# EAGLE schematic TX_test (EAGLE 9.5.0)
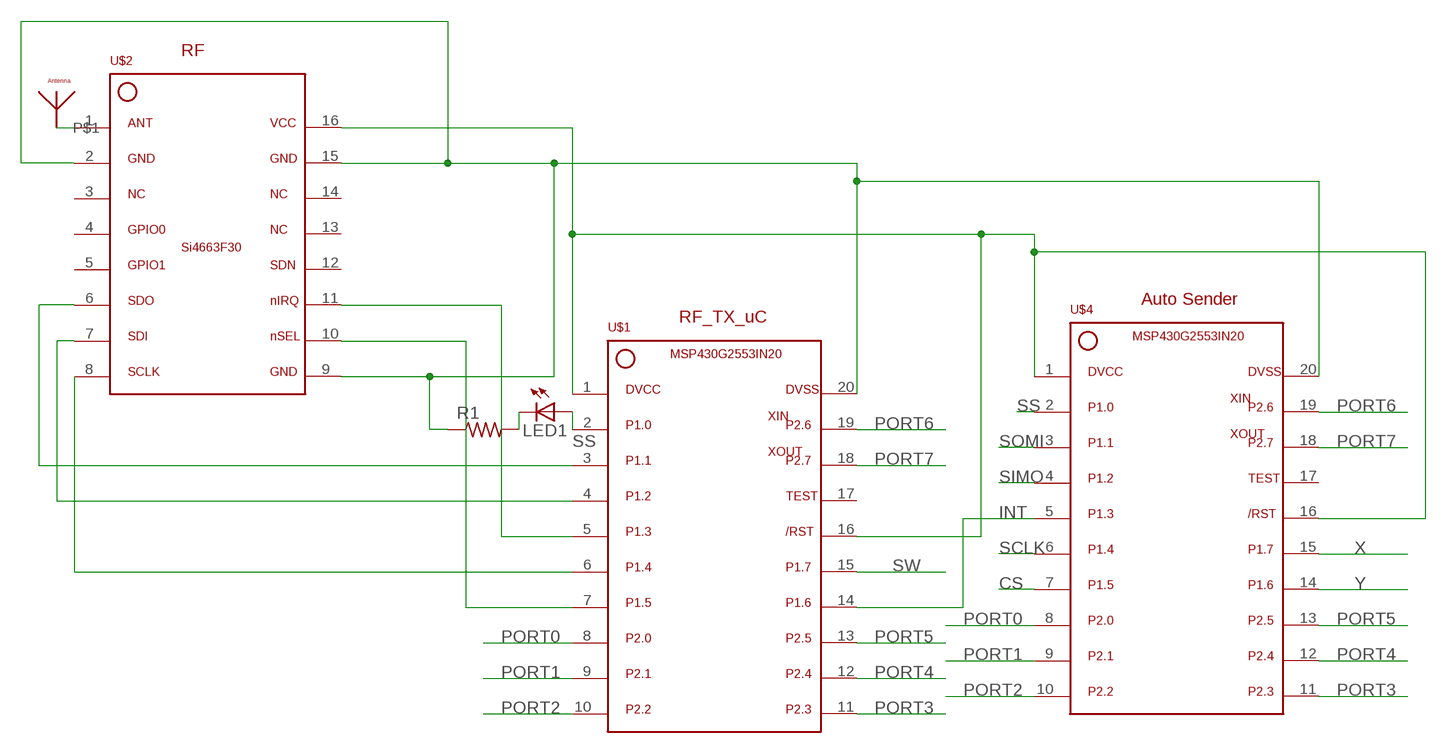
[diagram p0: schematic, sheet 1]

## Parts
LED1  LED3MM  [LED3MM]
R1  R-US_0204/7  [0204/7]
U$1  MSP430G2553IN20  [DIP762W53P254L2215H508Q20B]
U$2  SI4663F30SI4663F30-3D  [INDCAV400P3800X2000X400-16N]
U$3  ANTENNA  [ANTENNA]
U$4  MSP430G2553IN20  [DIP762W53P254L2215H508Q20B]

## Nets
CS: U$4.7
INT: U$1.14 U$4.5
N$1: U$1.1 U$1.16 U$2.16 U$4.1 U$4.16
N$2: U$2.1 U$3.P$1
N$3: R1.1 U$1.20 U$2.2 U$2.9 U$2.15 U$4.20
N$5: U$1.7 U$2.10
N$6: U$1.3 U$2.6
N$7: U$1.4 U$2.7
N$8: U$1.6 U$2.8
N$9: U$1.5 U$2.11
N$10: LED1.K(C) R1.2
PORT0: U$1.8 U$4.8
PORT1: U$1.9 U$4.9
PORT2: U$1.10 U$4.10
PORT3: U$1.11 U$4.11
PORT4: U$1.12 U$4.12
PORT5: U$1.13 U$4.13
PORT6: U$1.19 U$4.19
PORT7: U$1.18 U$4.18
SCLK: U$4.6
SIMO: U$4.4
SOMI: U$4.3
SS: LED1.A U$1.2 U$4.2
SW: U$1.15
X: U$4.15
Y: U$4.14
Unconnected: U$1.17 U$2.3 U$2.4 U$2.5 U$2.12 U$2.13 U$2.14 U$4.17

## Notes on the sheet
- RF
- Auto Sender
- RF_TX_uC

## Library data of the parts
LED1 = Phase_2:LED: LED OSRAM: - CHIPLED LG R971, LG N971, LY N971, LG Q971, LY Q971, LO R971, LY R971 LH N974, LH R974 LS Q976, LO Q976, LY Q976 LO Q996 - Hyper CHIPLED LW Q18S LB Q993, LB Q99A, LB R99A - SideLED LS A670, LO A670, LY A670, LG A670, LP A670 LB A673, LV A673, LT A673, LW A673 LH A674 LY A675 LS A676, LA A676, LO A676, LY A676, LW A676 LS A679, LY A679, LG A679 - Hyper Micro SIDELED® LS Y876, LA Y876, LO Y876, LY Y876 LT Y87S - SmartLED LW L88C, LW L88S LB L89C, LB L89S, LG L890 LS L89K, LO L89K, LY L89K LS L896, LA L896, LO L896, LY L896 - TOPLED LS T670, LO T670, LY T670, LG T670, LP T670 LSG T670, LSP T670, LSY T670, LOP T670, LYG T670 LG T671, LOG T671, LSG T671 LB T673, LV T673, LT T673, LW T673 LH T674 LS T676, LA T676, LO T676, LY T676, LB T676, LH T676, LSB T676, LW T676 LB T67C, LV T67C, LT T67C, LS T67K, LO T67K, LY T67K, LW E67C LS E67B, LA E67B, LO E67B, LY E67B, LB E67C, LV E67C, LT E67C LW T67C LS T679, LY T679, LG T679 LS T770, LO T770, LY T770, LG T770, LP T770 LB T773, LV T773, LT T773, LW T773 LH T774 LS E675, LA E675, LY E675, LS T675 LS T776, LA T776, LO T776, LY T776, LB T776 LHGB T686 LT T68C, LB T68C - Hyper Mini TOPLED® LB M676 - Mini TOPLED Santana® LG M470 LS M47K, LO M47K, LY M47K Source: http://www.osram.convergy.de/
R1 = Phase_2:R-US_: RESISTOR, American symbol
U$1 U$4 = Phase_2:MSP430G2553IN20
U$2 = Phase_2:SI4663F30: 1W Long Range RF Module from NiceRF. Si4663F30
U$3 = Phase_2:ANTENNA